# Altium schematic sheet EN-C200_RA0_MCU.SchDoc
size A4
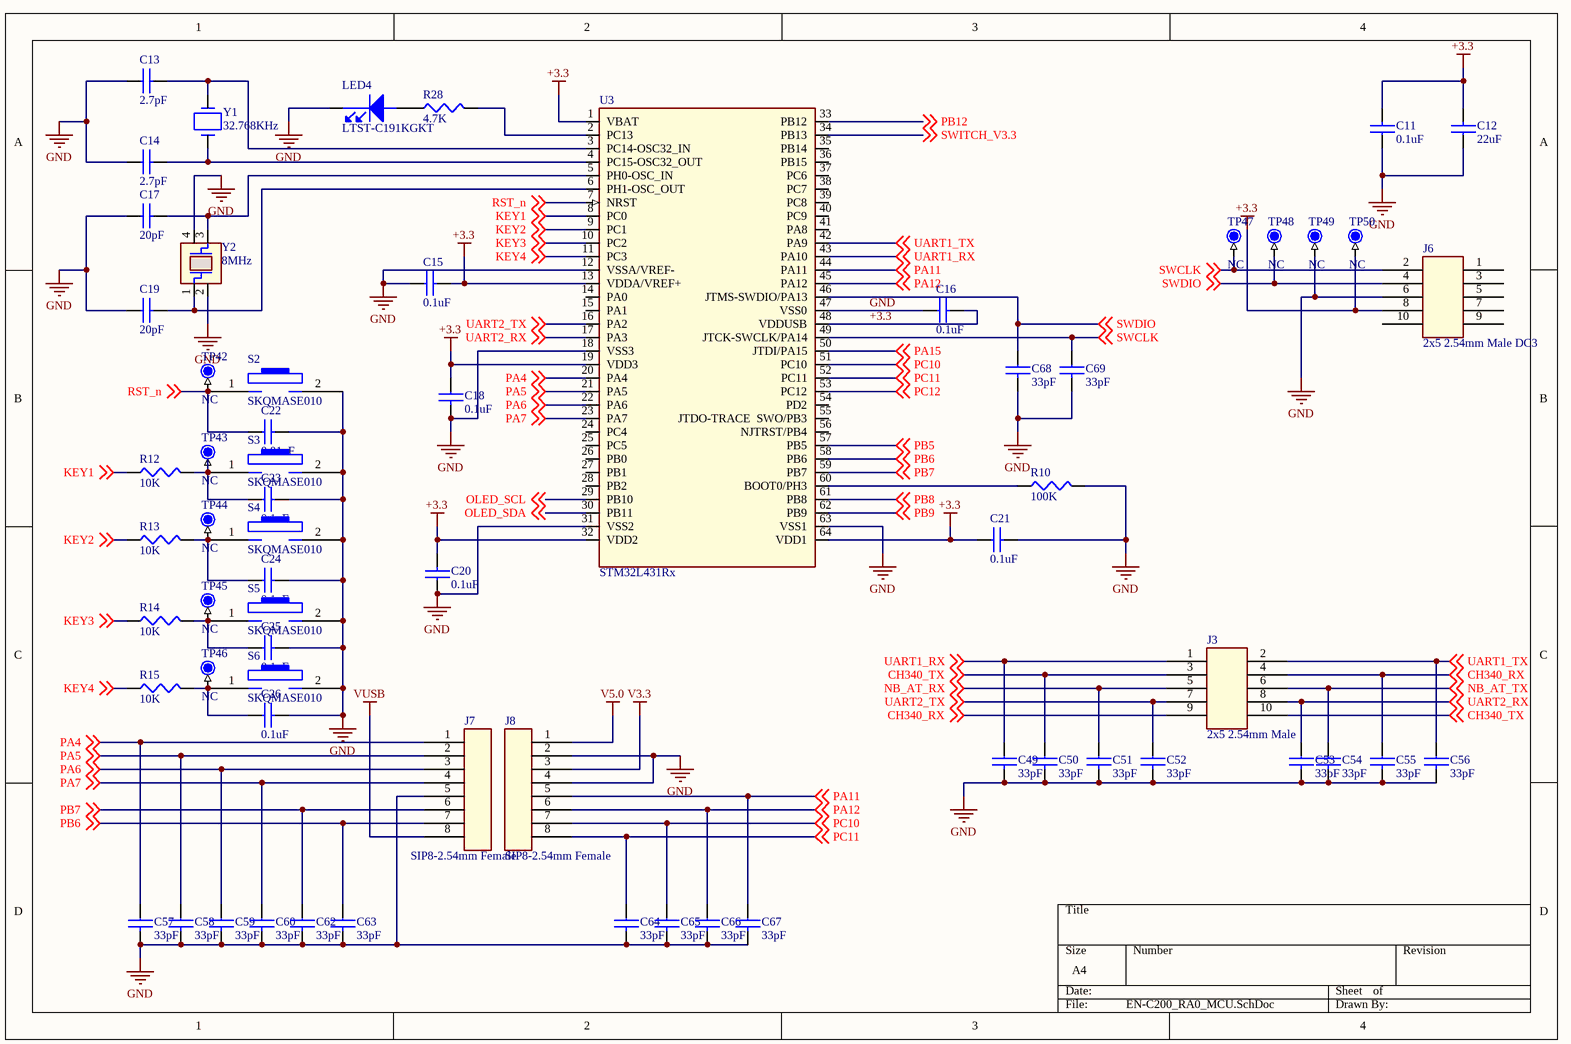
[diagram p0: EN-C200_RA0_MCU.SchDoc]

## Parts
C11  0.1uF  [SC0603]
C12  22uF  [SC0805]
C13  2.7pF  [SC0603]
C14  2.7pF  [SC0603]
C15  0.1uF  [SC0603]
C16  0.1uF  [SC0603]
C17  20pF  [SC0603]
C18  0.1uF  [SC0603]
C19  20pF  [SC0603]
C20  0.1uF  [SC0603]
C21  0.1uF  [SC0603]
C22  0.01uF  [SC0603]
C23  0.1uF  [SC0603]
C24  0.1uF  [SC0603]
C25  0.1uF  [SC0603]
C26  0.1uF  [SC0603]
C49  33pF  [SC0603]
C50  33pF  [SC0603]
C51  33pF  [SC0603]
C52  33pF  [SC0603]
C53  33pF  [SC0603]
C54  33pF  [SC0603]
C55  33pF  [SC0603]
C56  33pF  [SC0603]
C57  33pF  [SC0603]
C58  33pF  [SC0603]
C59  33pF  [SC0603]
C60  33pF  [SC0603]
C62  33pF  [SC0603]
C63  33pF  [SC0603]
C64  33pF  [SC0603]
C65  33pF  [SC0603]
C66  33pF  [SC0603]
C67  33pF  [SC0603]
C68  33pF  [SC0603]
C69  33pF  [SC0603]
J3  2x5 2.54mm Male  [SIP-2X5P-100]
J6  2x5 2.54mm Male DC3  [SIP-2X5P-100-DS]
J7  SIP8-2.54mm Female  [SIP-8P-100]
J8  SIP8-2.54mm Female  [SIP-8P-100]
LED4  LTST-C191KGKT  [HSD0603-LED]
R10  100K  [SR0603]
R12  10K  [SR0603]
R13  10K  [SR0603]
R14  10K  [SR0603]
R15  10K  [SR0603]
R28  4.7K  [SR0603]
S2  SKQMASE010  [SW2-240X140]
S3  SKQMASE010  [SW2-240X140]
S4  SKQMASE010  [SW2-240X140]
S5  SKQMASE010  [SW2-240X140]
S6  SKQMASE010  [SW2-240X140]
TP42  NC  [TP32-SMD]
TP43  NC  [TP32-SMD]
TP44  NC  [TP32-SMD]
TP45  NC  [TP32-SMD]
TP46  NC  [TP32-SMD]
TP47  NC  [TP32-SMD]
TP48  NC  [TP32-SMD]
TP49  NC  [TP32-SMD]
TP50  NC  [TP32-SMD]
U3  STM32L431Rx  [QFP64D-050-1010L]
Y1  32.768KHz  [FC-135_110]
Y2  8MHz  [HSX4-0503B]

## Nets
+3.3: C11.2 C12.2 C15.2 C16.2 C18.1 C20.2 C21.1 J6.8 TP50.1 U3.1(VBAT) U3.13(VDDA/VREF+) U3.19(VDD3) U3.32(VDD2) U3.48(VDDUSB) U3.64(VDD1)
GND: C11.1 C12.1 C13.1 C14.1 C15.1 C16.1 C17.1 C18.2 C19.1 C20.1 C21.2 C22.2 C23.2 C24.2 C25.2 C26.2 C49.2 C50.2 C51.2 C52.2 C53.2 C54.2 C55.2 C56.2 C57.2 C58.2 C59.2 C60.2 C62.2 C63.2 C64.2 C65.2 C66.2 C67.2 C68.2 C69.2 J6.6 J7.5 J8.2 J8.4 LED4.2 R10.2 S2.2(B) S3.2(B) S4.2(B) S5.2(B) S6.2(B) TP49.1 U3.12(VSSA/VREF-) U3.18(VSS3) U3.31(VSS2) U3.47(VSS0) U3.63(VSS1) Y2.2 Y2.4
V3.3: J8.3
V5.0: J8.1
VUSB: J7.8
CH340_RX: C55.1 J3.4 J3.9 ; off-sheet CH340_RX
CH340_TX: C50.1 J3.3 J3.10 ; off-sheet CH340_TX
KEY1: R12.1 U3.8(PC0) ; off-sheet KEY1
KEY2: R13.1 U3.9(PC1) ; off-sheet KEY2
KEY3: R14.1 U3.10(PC2) ; off-sheet KEY3
KEY4: R15.1 U3.11(PC3) ; off-sheet KEY4
NB_AT_RX: C51.1 J3.5 ; off-sheet NB_AT_RX
NB_AT_TX: C54.1 J3.6 ; off-sheet NB_AT_TX
OLED_SCL: U3.29(PB10) ; off-sheet OLED_SCL
OLED_SDA: U3.30(PB11) ; off-sheet OLED_SDA
PA4: C57.1 J7.1 U3.20(PA4) ; off-sheet PA4
PA5: C58.1 J7.2 U3.21(PA5) ; off-sheet PA5
PA6: C59.1 J7.3 U3.22(PA6) ; off-sheet PA6
PA7: C60.1 J7.4 U3.23(PA7) ; off-sheet PA7
PA11: C67.1 J8.5 U3.44(PA11) ; off-sheet PA11
PA12: C66.1 J8.6 U3.45(PA12) ; off-sheet PA12
PA15: U3.50(JTDI/PA15) ; off-sheet PA15
PB5: U3.57(PB5) ; off-sheet PB5
PB6: C63.1 J7.7 U3.58(PB6) ; off-sheet PB6
PB7: C62.1 J7.6 U3.59(PB7) ; off-sheet PB7
PB8: U3.61(PB8) ; off-sheet PB8
PB9: U3.62(PB9) ; off-sheet PB9
PB12: U3.33(PB12) ; off-sheet PB12
PC10: C65.1 J8.7 U3.51(PC10) ; off-sheet PC10
PC11: C64.1 J8.8 U3.52(PC11) ; off-sheet PC11
PC12: U3.53(PC12) ; off-sheet PC12
RST_n: C22.1 S2.1(A) TP42.1 U3.7(NRST) ; off-sheet RST_n
SWCLK: C69.1 J6.2 TP47.1 U3.49(JTCK-SWCLK/PA14) ; off-sheet SWCLK
SWDIO: C68.1 J6.4 TP48.1 U3.46(JTMS-SWDIO/PA13) ; off-sheet SWDIO
SWITCH_V3.3: U3.34(PB13) ; off-sheet SWITCH_V3.3
UART1_RX: C49.1 J3.1 U3.43(PA10) ; off-sheet UART1_RX
UART1_TX: C56.1 J3.2 U3.42(PA9) ; off-sheet UART1_TX
UART2_RX: C53.1 J3.8 U3.17(PA3) ; off-sheet UART2_RX
UART2_TX: C52.1 J3.7 U3.16(PA2) ; off-sheet UART2_TX
NetC13_2: C13.2 U3.3(PC14-OSC32_IN) Y1.2
NetC14_2: C14.2 U3.4(PC15-OSC32_OUT) Y1.1
NetC17_2: C17.2 U3.5(PH0-OSC_IN) Y2.3(COUT)
NetC19_2: C19.2 U3.6(PH1-OSC_OUT) Y2.1(CIN)
NetC23_1: C23.1 R12.2 S3.1(A) TP43.1
NetC24_1: C24.1 R13.2 S4.1(A) TP44.1
NetC25_1: C25.1 R14.2 S5.1(A) TP45.1
NetC26_1: C26.1 R15.2 S6.1(A) TP46.1
NetLED4_1: LED4.1 R28.1
NetR10_1: R10.1 U3.60(BOOT0/PH3)
NetR28_2: R28.2 U3.2(PC13)

Not connected (* = marked no-connect by the designer): J6 1 3 5 7 9 10; U3 14(PA0) 15(PA1) 24(PC4) 25(PC5) 26(PB0) 27(PB1) 28(PB2) 35(PB14) 36(PB15) 37(PC6) 38(PC7) 39(PC8) 40(PC9) 41(PA8) 54(PD2) 55(JTDO-TRACE__SWO/PB3) 56(NJTRST/PB4)

## Library data of the parts
C11-C26 C49-C60 C62-C69 = CAP NP
J3 J6 = CON10A
J7 J8 = HEADER8
LED4 = LED
R10 R12-R15 R28 = RESISTOR
S2-S6 = PUSH-KEY
TP42-TP50 = TP
Y1 = CRYSTAL2P
Y2 = CRYSTAL4P